# EAGLE design otg-usb (EAGLE 6.1)
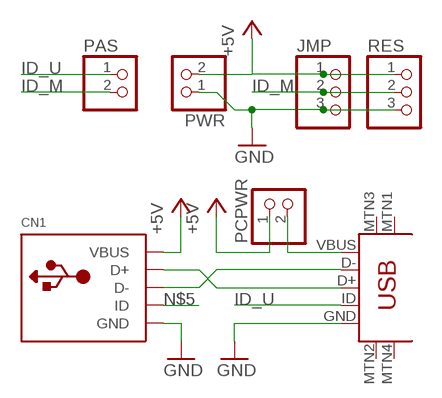
[diagram p0: schematic, sheet 1]

## Parts
CN1  USBMINIB  [USB-MINIB]
JMP  PINHD-1X3  [1X03]
PAS  PINHD-1X2  [1X02]
PCPWR  PINHD-1X2  [1X02]
PWR  PINHD-1X2  [1X02]
RES  PINHD-1X3  [1X03]
U$1  USB-MINIB-5PIN  [USB-MINIB]

## Nets
+5V: CN1.VBUS PCPWR.1 PWR.2
GND: CN1.GND JMP.3 PWR.1 RES.3 U$1.GND
ID_M: JMP.2 PAS.2 RES.2
ID_U: PAS.1 U$1.ID
N$1: CN1.D+ U$1.D+
N$2: CN1.D- U$1.D-
N$4: JMP.1 RES.1
N$5: CN1.ID
N$6: PCPWR.2 U$1.VBUS
Unconnected: U$1.MTN1(MTN2) U$1.MTN2(MTN3) U$1.MTN3(MTN1) U$1.MTN4

## Library data of the parts
CN1 = adafruit_t10:USB: USB Connectors USBMINIB - Surface Mount Female Mini-B USB Connector 4UConnector: 06564 By microbuilder.eu Thru-hole RA Female Mini-B USB Connector 4UConnector: 18732 By ladyada.net
JMP RES = pinhead:PINHD-1X3: PIN HEADER
PAS PCPWR PWR = pinhead:PINHD-1X2: PIN HEADER
U$1 = SparkFun-Connectors:USB-MINIB: Mini-USB "B" connector with 5th pin broken out. Created new symbol breaking out 5th "ID" pin in mini/micro USB connector spec. See: http://en.wikipedia.org/wiki/Mini_usb#Cables. Uses same footprint as 4-pin symbol. Also added pins to connect to mounting / shield pads if required (probably not generally needed as signals aren't shielded once they leave the connector).

## Board
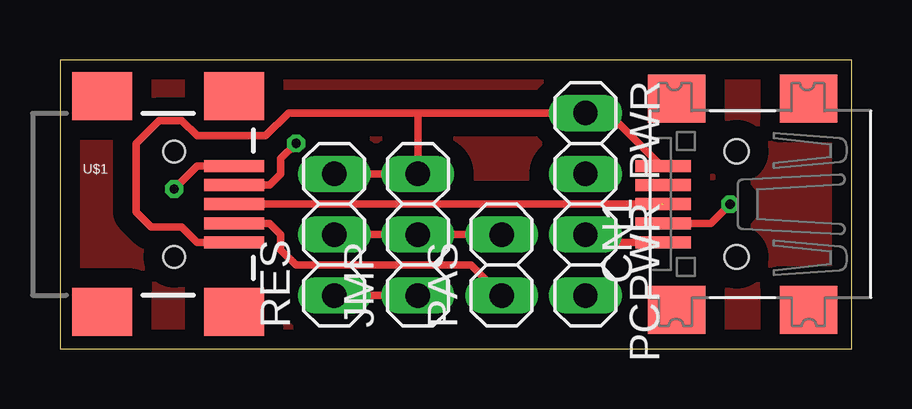
[diagram p1: board, top side]
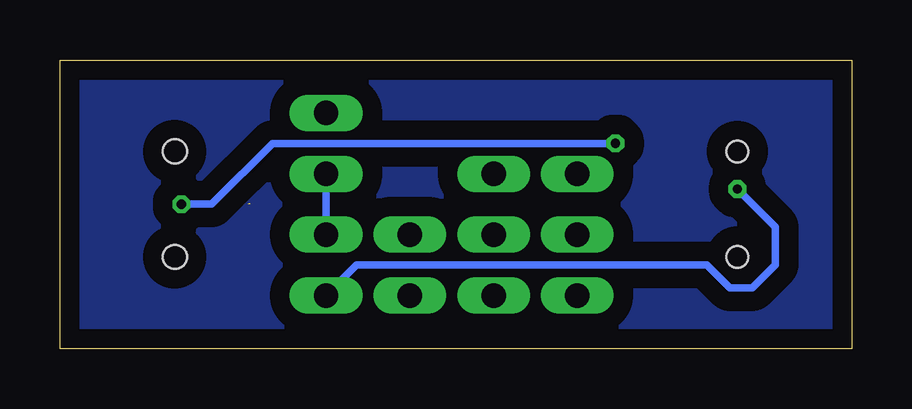
[diagram p2: board, bottom side, seen from below]

Size 33 x 12.05 mm. Coordinates in mm from the lower left corner, seen from the top.
Outline: 0,0 33,0 33,12.05 0,12.05 0,0
Copper layers (1*16): Top 0.0356mm / dielectric 1.5011mm / Bottom 0.0356mm
Design rules: minimum track width 6mil, minimum drill 13mil, track to track 6mil, track to pad 6mil, pad to pad 6mil, via to via 6mil, smd to smd 6mil, copper to edge 15mil, drill to drill 6mil, minimum pad ring 7mil, minimum via ring 7mil, stop-mask expansion 3mil, vias tented up to drill 0mil, thermal gap 10mil

### Footprints (pad centres in the part's own frame; a part is rotated, then mirrored left to right if it is on the bottom)
USB-MINIB = smd 0.5 x 2.308: D+ 0,4.064; D- -0.8,4.064; GND 1.6,4.064; ID 0.8,4.064; VBUS -1.6,4.064 | smd 2 x 2.4: GND1 -4.4,-2; GND2 -4.4,3.5; GND3 4.4,3.5; GND4 4.4,-2 | hole 1: -2.2,1; 2.2,1
1X03 = drill 1.016 long: 1 -2.54,0; 2 0,0; 3 2.54,0
1X02 = drill 1.016 long: 1 -1.27,0; 2 1.27,0
USB-MINIB' = smd 2.5 x 0.5: D+ 2.5,0; D- 2.5,0.8; GND 2.5,-1.6; ID 2.5,-0.8; VBUS 2.5,1.6 | smd 2.5 x 2: MTN1 -3,4.5; MTN2 2.5,4.5; MTN3 -3,-4.5; MTN4 2.5,-4.5 | hole 0.9: 0,2.2; 0,-2.2

### Placement (x,y rotation side)
CN1  29.21,6.03 90 top
JMP  14.92,4.76 90 top
PAS  18.42,3.49 90 top
PCPWR  21.91,3.49 270 top
PWR  21.91,8.57 270 top
RES  11.43,4.76 90 top
U$1  USB-MINIB-5PIN  [USB-MINIB']  4.76,6.03 0 top

### Tracks (layer width: path | path; a pad name or v marks a point on that pad's centre or on a via)
+5V
  Top 0.305: CN1.VBUS 22.24,4.43 PCPWR.1
  Bottom 0.305: PCPWR.1 PWR.2
GND
  Top 0.305: CN1.GND 25.07,7.63 22.86,9.84 PWR.1 14.92,9.84 | U$1.GND 7.25,4.45 5.72,4.45 5.08,5.08 3.81,5.08 3.18,5.71 3.18,8.57 4.13,9.53 5.08,9.53 5.72,8.89 8.57,8.89 9.53,9.84 14.92,9.84 | RES.3 JMP.3 14.92,9.84
ID_M
  Top 0.305: RES.2 JMP.2 PAS.2
ID_U
  Top 0.305: U$1.ID 8.74,5.23 9.21,4.76 9.21,4.13 9.84,3.49 17.15,3.49 PAS.1
N$1  (1 unrouted)
  Top 0.305: U$1.D+ 25.08,6.03
N$2  (via drill 0.38)
  Top 0.305: CN1.D- 27.14,5.23 v27.94,6.03 | v9.84,8.57 9.21,7.94 9.21,7.3 8.74,6.83 U$1.D-
  Bottom 0.305: v27.94,6.03 26.67,6.03 24.13,8.57 v9.84,8.57
N$4
  Top 0.305: RES.1 JMP.1
N$6  (via drill 0.38)
  Top 0.305: v4.76,6.67 5.72,7.62 7.25,7.62 U$1.VBUS
  Bottom 0.305: v4.76,6.67 3.18,5.08 3.18,3.49 4.13,2.54 5.08,2.54 6.03,3.49 20.64,3.49 PCPWR.2
N$7
  pour Bottom (isolate 0.813, no thermals): -0.32,-0.32 33.34,-0.32 33.34,12.38 -0.32,12.38
P+1
  pour Top (isolate 0.813, no thermals): 32.7,0.32 0.32,0.32 0.32,11.75 32.7,11.75